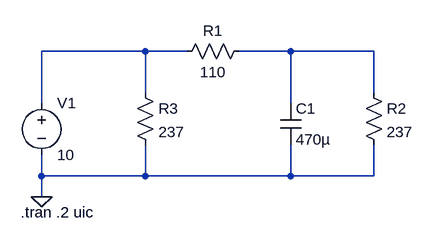
[diagram p0: schematic schematic.asc]
schematic.asc, the LTspice schematic file:
Version 4
SHEET 1 880 680
WIRE 272 48 112 48
WIRE 336 48 272 48
WIRE 496 48 416 48
WIRE 624 48 496 48
WIRE 272 112 272 48
WIRE 624 112 624 48
WIRE 112 128 112 48
WIRE 496 128 496 48
WIRE 112 240 112 208
WIRE 272 240 272 192
WIRE 272 240 112 240
WIRE 496 240 496 192
WIRE 496 240 272 240
WIRE 624 240 624 192
WIRE 624 240 496 240
WIRE 112 272 112 240
FLAG 112 272 0
SYMBOL voltage 112 112 R0
WINDOW 123 0 0 Left 2
WINDOW 39 0 0 Left 2
SYMATTR InstName V1
SYMATTR Value 10
SYMBOL res 320 64 R270
WINDOW 0 32 56 VTop 2
WINDOW 3 0 56 VBottom 2
SYMATTR InstName R1
SYMATTR Value 110
SYMBOL cap 480 128 R0
SYMATTR InstName C1
SYMATTR Value 470µ
SYMBOL res 608 96 R0
SYMATTR InstName R2
SYMATTR Value 237
SYMBOL res 256 96 R0
SYMATTR InstName R3
SYMATTR Value 237
TEXT 80 296 Left 2 !.tran .2 uic

The netlist it stands for:
* schematic.asc
V1 N001 0 10
R1 N001 N002 110
C1 N002 0 470µ
R2 N002 0 237
R3 N001 0 237
.tran .2 uic
.backanno
.end